# EAGLE design pwm-board (EAGLE 5.03)
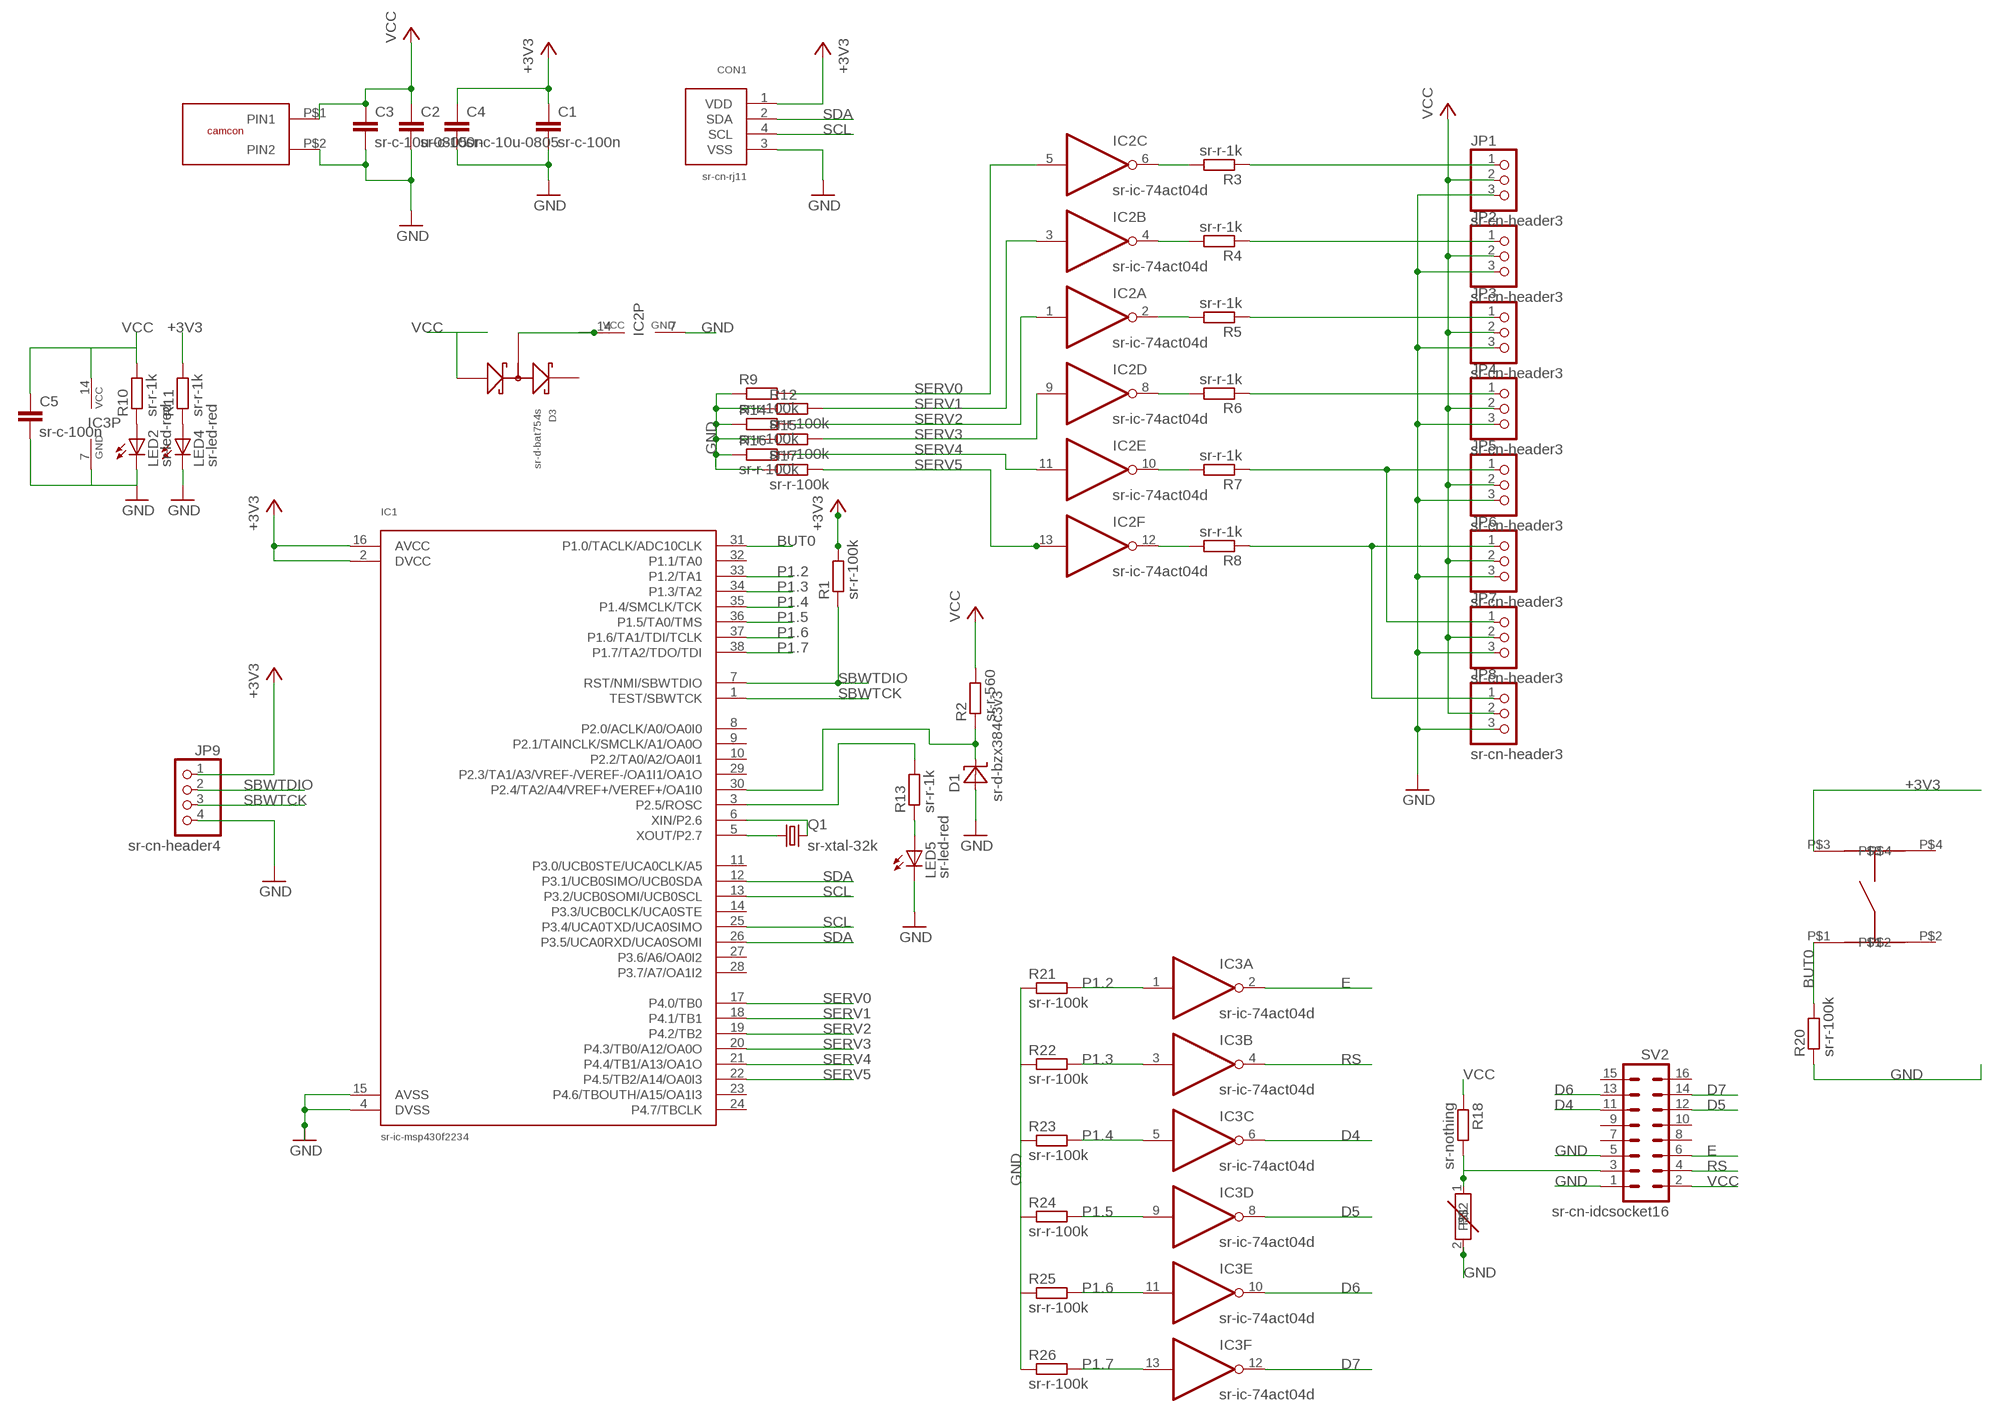
[diagram p0: schematic, sheet 1]

## Parts
C1  sr-c-100n  C-EUC0603K  [C0603K]
C2  sr-c-100n  C-EUC0603K  [C0603K]
C3  sr-c-10u-0805  C-EUC0805  [C0805]
C4  sr-c-10u-0805  C-EUC0805  [C0805]
C5  sr-c-100n  C-EUC0603  [C0603]
CON1  sr-cn-rj11  MODULE_CON  [RJ11-4P4C]
D1  sr-d-bzx384c3v3  ZENERBZX384-C3V3  [SOD323-W]
D3  sr-d-bat754s  BAT754S  [SOT23]
IC1  sr-ic-msp430f2234  MSP430F2234  [TSSOP38]
IC2  sr-ic-74act04d  74ACT04D  [SO14]
IC3  sr-ic-74act04d  74ACT04D  [SO14]
JP1  sr-cn-header3  PINHD-1X3  [1X03]
JP2  sr-cn-header3  PINHD-1X3  [1X03]
JP3  sr-cn-header3  PINHD-1X3  [1X03]
JP4  sr-cn-header3  PINHD-1X3  [1X03]
JP5  sr-cn-header3  PINHD-1X3  [1X03]
JP6  sr-cn-header3  PINHD-1X3  [1X03]
JP7  sr-cn-header3  PINHD-1X3  [1X03]
JP8  sr-cn-header3  PINHD-1X3  [1X03]
JP9  sr-cn-header4  PINHD-1X4  [1X04]
LED2  sr-led-red  LEDCHIP-LED0603  [CHIP-LED0603]
LED4  sr-led-red  LEDCHIP-LED0603  [CHIP-LED0603]
LED5  sr-led-red  LEDCHIP-LED0603  [CHIP-LED0603]
Q1  sr-xtal-32k  CRYSTALTC26V  [TC26V]
R1  sr-r-100k  R-EU_R0603  [R0603]
R2  sr-r-560  R-EU_R0603  [R0603]
R3  sr-r-1k  R-EU_R0603  [R0603]
R4  sr-r-1k  R-EU_R0603  [R0603]
R5  sr-r-1k  R-EU_R0603  [R0603]
R6  sr-r-1k  R-EU_R0603  [R0603]
R7  sr-r-1k  R-EU_R0603  [R0603]
R8  sr-r-1k  R-EU_R0603  [R0603]
R9  sr-r-100k  R-EU_R0603  [R0603]
R10  sr-r-1k  R-EU_R0603  [R0603]
R11  sr-r-1k  R-EU_R0603  [R0603]
R12  sr-r-100k  R-EU_R0603  [R0603]
R13  sr-r-1k  R-EU_R0603  [R0603]
R14  sr-r-100k  R-EU_R0603  [R0603]
R15  sr-r-100k  R-EU_R0603  [R0603]
R16  sr-r-100k  R-EU_R0603  [R0603]
R17  sr-r-100k  R-EU_R0603  [R0603]
R18  sr-nothing  R-EU_R0603  [R0603]
R20  sr-r-100k  R-EU_R0603  [R0603]
R21  sr-r-100k  R-EU_R0603  [R0603]
R22  sr-r-100k  R-EU_R0603  [R0603]
R23  sr-r-100k  R-EU_R0603  [R0603]
R24  sr-r-100k  R-EU_R0603  [R0603]
R25  sr-r-100k  R-EU_R0603  [R0603]
R26  sr-r-100k  R-EU_R0603  [R0603]
SV2  sr-cn-idcsocket16  ML163M  [3M_16]
U$1  sr-cn-camcon2w  CAMCON2W  [09CON2W]
U$2  sr-nothing  R-CUT  [R0603]
U$3  sr-sw-button  09SWITCH  [09SW]

## Nets
+3V3: C1.1 C4.1 CON1.1(VDD) IC1.2(DVCC) IC1.16(AVCC) JP9.1 R1.2 R11.2 U$3.P$3
BUT0: IC1.31(P1.0/TACLK/ADC10CLK) R20.2 U$3.P$1
D4: IC3.6(C:O) SV2.11
D5: IC3.8(D:O) SV2.12
D6: IC3.10(E:O) SV2.13
D7: IC3.12(F:O) SV2.14
E: IC3.2(A:O) SV2.6
GND: C1.2 C2.2 C3.2 C4.2 C5.2 CON1.3(VSS) D1.A IC1.4(DVSS) IC1.15(AVSS) IC2.7(P:GND) IC3.7(P:GND) JP1.3 JP2.3 JP3.3 JP4.3 JP5.3 JP6.3 JP7.3 JP8.3 JP9.4 LED2.C LED4.C LED5.C R9.1 R12.1 R14.1 R15.1 R16.1 R17.1 R20.1 R21.1 R22.1 R23.1 R24.1 R25.1 R26.1 SV2.1 SV2.5 U$1.P$2(PIN2) U$2.2
N$1: JP5.1 JP7.1 R7.1
N$2: JP6.1 JP8.1 R8.1
N$3: D1.C IC1.30(P2.4/TA2/A4/VREF+/VEREF+/OA1I0) R2.1
N$4: IC2.6(C:O) R3.2
N$5: IC2.4(B:O) R4.2
N$7: IC2.2(A:O) R5.2
N$8: IC2.8(D:O) R6.2
N$9: IC2.10(E:O) R7.2
N$10: LED2.A R10.1
N$11: D3.3(MID) IC2.14(P:VCC)
N$12: LED4.A R11.1
N$13: IC2.12(F:O) R8.2
N$14: JP1.1 R3.1
N$15: JP2.1 R4.1
N$16: JP3.1 R5.1
N$17: JP4.1 R6.1
N$22: IC1.5(XOUT/P2.7) Q1.1
N$23: IC1.3(P2.5/ROSC) R13.2
N$24: IC1.6(XIN/P2.6) Q1.2
N$26: LED5.A R13.1
N$28: R18.2 SV2.3 U$2.1
P1.2: IC1.33(P1.2/TA1) IC3.1(A:I) R21.2
P1.3: IC1.34(P1.3/TA2) IC3.3(B:I) R22.2
P1.4: IC1.35(P1.4/SMCLK/TCK) IC3.5(C:I) R23.2
P1.5: IC1.36(P1.5/TA0/TMS) IC3.9(D:I) R24.2
P1.6: IC1.37(P1.6/TA1/TDI/TCLK) IC3.11(E:I) R25.2
P1.7: IC1.38(P1.7/TA2/TDO/TDI) IC3.13(F:I) R26.2
RS: IC3.4(B:O) SV2.4
SBWTCK: IC1.1(TEST/SBWTCK) JP9.3
SBWTDIO: IC1.7(RST/NMI/SBWTDIO) JP9.2 R1.1
SCL: CON1.4(SCL) IC1.13(P3.2/UCB0SOMI/UCB0SCL) IC1.25(P3.4/UCA0TXD/UCA0SIMO)
SDA: CON1.2(SDA) IC1.12(P3.1/UCB0SIMO/UCB0SDA) IC1.26(P3.5/UCA0RXD/UCA0SOMI)
SERV0: IC1.17(P4.0/TB0) IC2.5(C:I) R9.2
SERV1: IC1.18(P4.1/TB1) IC2.3(B:I) R12.2
SERV2: IC1.19(P4.2/TB2) IC2.1(A:I) R14.2
SERV3: IC1.20(P4.3/TB0/A12/OA0O) IC2.9(D:I) R15.2
SERV4: IC1.21(P4.4/TB1/A13/OA1O) IC2.11(E:I) R16.2
SERV5: IC1.22(P4.5/TB2/A14/OA0I3) IC2.13(F:I) R17.2
VCC: C2.1 C3.1 C5.1 D3.1(ANODE) IC3.14(P:VCC) JP1.2 JP2.2 JP3.2 JP4.2 JP5.2 JP6.2 JP7.2 JP8.2 R2.2 R10.2 R18.1 SV2.2 U$1.P$1(PIN1)
Unconnected: D3.2(CATHODE) IC1.8(P2.0/ACLK/A0/OA0I0) IC1.9(P2.1/TAINCLK/SMCLK/A1/OA0O) IC1.10(P2.2/TA0/A2/OA0I1) IC1.11(P3.0/UCB0STE/UCA0CLK/A5) IC1.14(P3.3/UCB0CLK/UCA0STE) IC1.23(P4.6/TBOUTH/A15/OA1I3) IC1.24(P4.7/TBCLK) IC1.27(P3.6/A6/OA0I2) IC1.28(P3.7/A7/OA1I2) IC1.29(P2.3/TA1/A3/VREF-/VEREF-/OA1I1/OA1O) IC1.32(P1.1/TA0) SV2.7 SV2.8 SV2.9 SV2.10 SV2.15 SV2.16 U$3.P$2 U$3.P$4

## Library data of the parts
C1-C5 = rcl:C-EU: CAPACITOR, European symbol
CON1 = ecssr:MODULE_CON
D1 = ecssr:ZENER
D3 = ecssr:BAT754S
IC1 = ecssr:MSP430F2234
IC2 IC3 = 74xx-eu:74*04: Hex INVERTER
JP1-JP8 = pinhead:PINHD-1X3: PIN HEADER
JP9 = pinhead:PINHD-1X4: PIN HEADER
LED2 LED4 LED5 = led:LED: LED OSRAM: - CHIPLED LG R971, LG N971, LY N971, LG Q971, LY Q971, LO R971, LY R971 LH N974, LH R974 LS Q976, LO Q976, LY Q976 LO Q996 - Hyper CHIPLED LW Q18S LB Q993, LB Q99A, LB R99A - SideLED LS A670, LO A670, LY A670, LG A670, LP A670 LB A673, LV A673, LT A673, LW A673 LH A674 LY A675 LS A676, LA A676, LO A676, LY A676, LW A676 LS A679, LY A679, LG A679 - Hyper Micro SIDELED® LS Y876, LA Y876, LO Y876, LY Y876 LT Y87S - SmartLED LW L88C, LW L88S LB L89C, LB L89S, LG L890 LS L89K, LO L89K, LY L89K LS L896, LA L896, LO L896, LY L896 - TOPLED LS T670, LO T670, LY T670, LG T670, LP T670 LSG T670, LSP T670, LSY T670, LOP T670, LYG T670 LG T671, LOG T671, LSG T671 LB T673, LV T673, LT T673, LW T673 LH T674 LS T676, LA T676, LO T676, LY T676, LB T676, LH T676, LSB T676, LW T676 LB T67C, LV T67C, LT T67C, LS T67K, LO T67K, LY T67K, LW E67C LS E67B, LA E67B, LO E67B, LY E67B, LB E67C, LV E67C, LT E67C LW T67C LS T679, LY T679, LG T679 LS T770, LO T770, LY T770, LG T770, LP T770 LB T773, LV T773, LT T773, LW T773 LH T774 LS E675, LA E675, LY E675, LS T675 LS T776, LA T776, LO T776, LY T776, LB T776 LHGB T686 LT T68C, LB T68C - Hyper Mini TOPLED® LB M676 - Mini TOPLED Santana® LG M470 LS M47K, LO M47K, LY M47K Source: http://www.osram.convergy.de - LUMILED® LXK2-PW12-R00, LXK2-PW12-S00, LXK2-PW14-U00, LXK2-PW14-V00 LXK2-PM12-R00, LXK2-PM12-S00, LXK2-PM14-U00 LXK2-PE12-Q00, LXK2-PE12-R00, LXK2-PE12-S00, LXK2-PE14-T00, LXK2-PE14-U00 LXK2-PB12-K00, LXK2-PB12-L00, LXK2-PB12-M00, LXK2-PB14-N00, LXK2-PB14-P00, LXK2-PB14-Q00 LXK2-PR12-L00, LXK2-PR12-M00, LXK2-PR14-Q00, LXK2-PR14-R00 LXK2-PD12-Q00, LXK2-PD12-R00, LXK2-PD12-S00 LXK2-PH12-R00, LXK2-PH12-S00 LXK2-PL12-P00, LXK2-PL12-Q00, LXK2-PL12-R00 Source: www.luxeon.com
Q1 = crystal:CRYSTAL: CRYSTAL
R1-R18 R20-R26 = rcl:R-EU_: RESISTOR, European symbol
SV2 = con-harting-ml:ML16: HARTING
U$1 = ecssr-Pwr:CAMCON2W
U$2 = ecssr:R-CUT
U$3 = ecssr-Pwr:09SWITCH

## Board
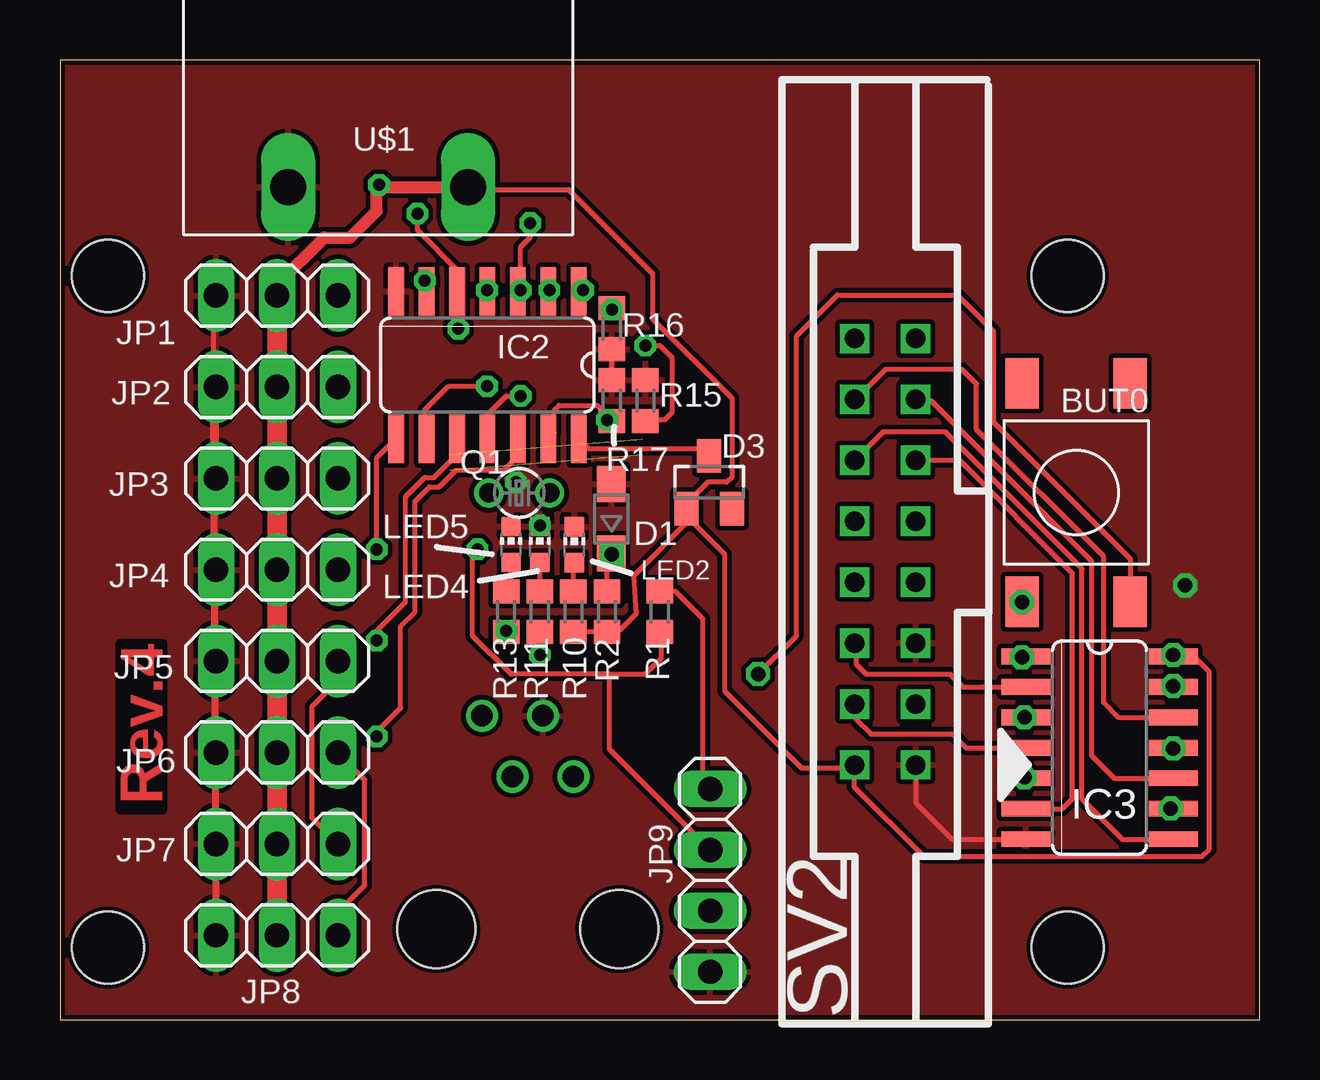
[diagram p1: board, top side]
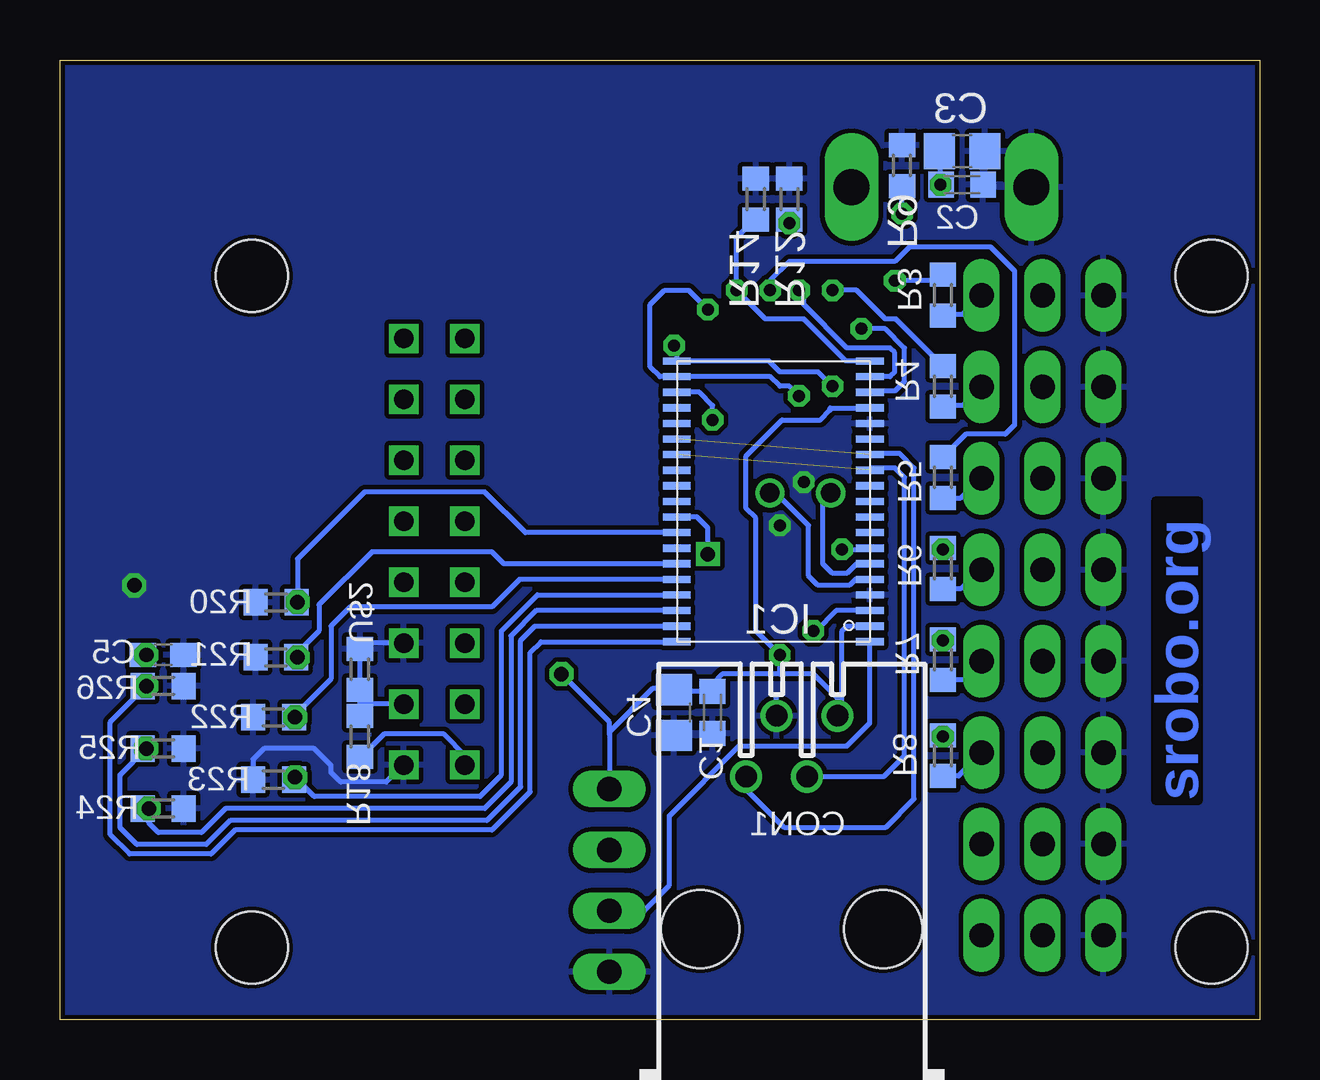
[diagram p2: board, bottom side, seen from below]

Size 50 x 40 mm. Coordinates in mm from the lower left corner, seen from the top.
Outline: 0,40 0,0 50,0 50,40 0,40
Copper layers (1*16): Top 0.035mm / dielectric 1.5mm / Bottom 0.035mm
Design rules "default": minimum track width 0.2mm, minimum drill 0.5mm, track to track 0.2mm, track to pad 0.2mm, pad to pad 0.2mm, via to via 0.2mm, smd to smd 0mil, copper to edge 0.2mm, drill to drill 0.2mm, minimum pad ring 0.2mm, minimum via ring 0.2mm, stop-mask expansion 0mil, vias tented up to drill 0mil, thermal gap 0.2mm
Holes 3 mm at 2,31 42,31 2,3 42,3

### Footprints (pad centres in the part's own frame; a part is rotated, then mirrored left to right if it is on the bottom)
C0603K = smd 1.05 x 1.08: 1 -0.875,0; 2 0.875,0
C0805 = smd 1.3 x 1.5: 1 -0.95,0; 2 0.95,0
C0603 = smd 1.1 x 1: 1 -0.85,0; 2 0.85,0
RJ11-4P4C = drill 0.889 round: 1 1.905,8.89; 2 0.635,6.35; 3 -0.635,8.89; 4 -1.905,6.35 | hole 3.251: -3.81,0; 3.81,0
SOD323-W = smd 1.5 x 1.2: A 1.45,0; C -1.45,0
SOT23 = smd 1 x 1.4: 1 -0.95,-1.1; 2 0.95,-1.1; 3 0,1.1
TSSOP38 = smd 1.15 x 0.3: 1 0,0; 2 0,-0.65; 3 0,-1.3; 4 0,-1.95; 5 0,-2.6; 6 0,-3.25; 7 0,-3.9; 8 0,-4.55; 9 0,-5.2; 10 0,-5.85; 11 0,-6.5; 12 0,-7.15; 13 0,-7.8; 14 0,-8.45; 15 0,-9.1; 16 0,-9.75; 17 0,-10.4; 18 0,-11.05; 19 0,-11.7; 20 8.05,-11.7; 21 8.05,-11.05; 22 8.05,-10.4; 23 8.05,-9.75; 24 8.05,-9.1; 25 8.05,-8.45; 26 8.05,-7.8; 27 8.05,-7.15; 28 8.05,-6.5; 29 8.05,-5.85; 30 8.05,-5.2; 31 8.05,-4.55; 32 8.05,-3.9; 33 8.05,-3.25; 34 8.05,-2.6; 35 8.05,-1.95; 36 8.05,-1.3; 37 8.05,-0.65; 38 8.05,0
SO14 = smd 0.66 x 2.032: 1 -3.81,-3.073; 2 -2.54,-3.073; 3 -1.27,-3.073; 4 0,-3.073; 5 1.27,-3.073; 6 2.54,-3.073; 7 3.81,-3.073; 8 3.81,3.073; 9 2.54,3.073; 10 1.27,3.073; 11 0,3.073; 12 -1.27,3.073; 13 -2.54,3.073; 14 -3.81,3.073
1X03 = drill 1.016 long: 1 -2.54,0; 2 0,0; 3 2.54,0
1X04 = drill 1.016 long: 1 -3.81,0; 2 -1.27,0; 3 1.27,0; 4 3.81,0
CHIP-LED0603 = smd 0.8 x 0.8: A 0,-0.75; C 0,0.75
TC26V = drill 0.813 round: 1 -1.27,0; 2 1.27,0
R0603 = smd 1 x 1.1: 1 -0.85,0; 2 0.85,0
3M_16 = drill 0.813 square: 1 -8.89,-1.27; 2 -8.89,1.27; 3 -6.35,-1.27; 4 -6.35,1.27; 5 -3.81,-1.27; 6 -3.81,1.27; 7 -1.27,-1.27; 8 -1.27,1.27; 9 1.27,-1.27; 10 1.27,1.27; 11 3.81,-1.27; 12 3.81,1.27; 13 6.35,-1.27; 14 6.35,1.27; 15 8.89,-1.27; 16 8.89,1.27
09CON2W = drill 1.5 long: P$1 -3.75,0; P$2 3.75,0
09SW = smd 1.4 x 2.1: P$1 2.25,4.55; P$2 2.25,-4.55; P$3 -2.25,4.55; P$4 -2.25,-4.55

### Placement (x,y rotation side)
C1  22.8,12.8 270 bottom
C2  12.4,34.8 0 bottom
C3  12.4,36.2 0 bottom
C4  24.4,12.8 270 bottom
C5  45.7,15.2 0 bottom
CON1  19.5,3.77 0 bottom
D1  22.98,20.87 90 top
D3  27.06,22.4 0 top
IC1  sr-ic-msp430f2254  [TSSOP38]  16.24,15.75 180 bottom
IC2  17.82,27.29 180 top
IC3  43.33,11.33 270 top
JP1  9.05,30.18 180 top
JP2  9.04,26.37 180 top
JP3  9.04,22.56 180 top
JP4  9.04,18.75 180 top
JP5  9.04,14.94 180 top
JP6  9.04,11.13 180 top
JP7  9.04,7.32 180 top
JP8  9.04,3.51 180 top
JP9  27.1,5.8 270 top
LED2  21.44,19.79 0 top
LED4  20,19.8 0 top
LED5  18.8,19.8 0 top
Q1  19.14,21.95 180 top
R1  25,17 90 top
R2  22.8,17 270 top
R3  13.2,30.2 90 bottom
R4  13.2,26.4 90 bottom
R5  13.2,22.6 90 bottom
R6  13.2,18.8 90 bottom
R7  13.2,15 90 bottom
R8  13.2,11 90 bottom
R9  14.9,35.6 270 bottom
R10  21.4,17 270 top
R11  20,17 270 top
R12  19.6,34.2 270 bottom
R13  18.6,17 270 top
R14  21,34.2 270 bottom
R15  24.4,25.8 270 top
R16  23,28.8 90 top
R17  23,25.8 270 top
R18  37.5,11.8 90 bottom
R20  40.99,17.39 0 bottom
R21  41,15.1 0 bottom
R22  41.1,12.6 0 bottom
R23  41.1,10 0 bottom
R24  45.7,8.8 180 bottom
R25  45.7,11.3 180 bottom
R26  45.7,13.9 180 bottom
SV2  34.4,19.5 90 top
U$1  13.26,34.7 180 top
U$2  37.5,14.6 90 bottom
U$3  42.36,21.97 180 top

### Tracks (layer width: path | path; a pad name or v marks a point on that pad's centre or on a via)
+3V3  (via drill 0.5, 0.6)
  Top 0.2: U$3.P$3 44.61,19.19 38.9,24.9 38.9,28.7 37.4,30.2 32.4,30.2 30.7,28.5 30.7,16 v29.1,14.4 | R1.2 25.65,17.85 26.8,16.7 26.8,9.9 JP9.1 | v20,15.2 R11.2 v20,15.2
  Bottom 0.2: IC1.2 17.2,16.4 17.4,16.2 17.4,12.8 | 20,14.4 18.6,14.4 17.6,13.4 17.6,12.7 17.59,12.69 CON1.1 | 20,14.4 22.4,14.4 22.8,14 C1.1 24.27,13.68 24.3,13.7 | 20,14.4 v20,15.2 21,16.2 21,20.9 21.4,21.3 21.4,23.5 19.9,25 18.3,25 17.9,25.4 17.9,25.5 IC1.16 | 24.4,13.8 C4.1 24.35,13.75 24.3,13.7 | 27.1,11.9 27.1,12 25.3,13.8 24.4,13.8 | 27.1,11.9 JP9.1 | 24.3,13.7 24.4,13.8 | v29.1,14.4 27.1,12.4 27.1,11.9
  Bottom 0.406: 17.4,12.8 17.59,12.8 CON1.1
BUT0  (via drill 0.6)
  Top 0.2: v40.1,17.4 U$3.P$1
  Bottom 0.2: R20.2 40.14,17.56 v40.1,17.4 40.1,19.2 37.3,22 32.3,22 30.6,20.3 IC1.31
D4
  Top 0.2: IC3.6 41.79,8.79 42.2,9.2 42.2,18.6 37.5,23.3 SV2.11
D5
  Top 0.2: IC3.8 44.28,7.52 42.6,9.2 42.6,18.8 36.9,24.5 34.3,24.5 33.11,23.31 | 33.11,23.31 33.1,23.3 | 33.11,23.31 SV2.12
D6
  Top 0.2: IC3.10 43.94,10.06 43,11 43,19.1 36.3,25.8 35.62,25.8 | 35.62,25.8 35.6,25.8 | 35.62,25.8 SV2.13
D7
  Top 0.2: IC3.12 44.1,12.6 43.5,13.2 43.5,19.3 38.2,24.6 38.2,26.5 37.6,27.1 34.4,27.1 33.13,25.83 | 33.13,25.83 33.1,25.8 | 33.13,25.83 SV2.14
E
  Top 0.2: IC3.2 37.63,13.87 37.1,14.4 33.6,14.4 33.2,14.8 33.2,15.6 33.11,15.69 | 33.11,15.69 33.1,15.7 | 33.11,15.69 SV2.6
GND  (via drill 0.5, 0.6)
  Top 0.2: 6.4,26.4 | 6.4,26.4 6.42,26.4 6.42,30.02 6.58,30.18 | 6.4,26.4 6.43,26.37 JP2.3 JP3.3 | JP3.3 | JP3.3 | 6.58,30.18 6.6,30.2 | 6.58,30.18 JP1.3 | 23.05,28 R16.1 R17.1 23,26.6 | IC3.7 37.18,7.52 35.7,9 35.7,10.6 35.69,10.61 SV2.1
  Top 0.3: 6.45,3.5 JP8.3 6.42,26.4
  Bottom 0.2: CON1.3 20.13,13.47 | SV2.5 37.35,15.7 U$2.2 | R23.1 41.95,10.85 41.5,11.3 39.4,11.3 38.7,10.6 38.7,10.3 38.3,9.9 36.4,9.9 35.69,10.61 SV2.1
  other vias: 20,20.6 46.9,18.1 19,22.4
  pour Top (isolate 0.2): -0.3,-0.4 -0.3,40.7 50.6,40.7 50.6,-0.4
  pour Bottom (isolate 0.2): -0.1,-0.6 -0.1,40.9 50.9,40.9 50.9,-0.6
N$1
  Top 0.2: JP5.1 11.53,15 11.5,15 11.5,14.05 10.5,13.05 10.5,8.4 JP7.1
  Bottom 0.2: JP5.1 11.6,15 | JP5.1 | R7.1 11.6,14.15 JP5.1
N$2
  Top 0.2: JP8.1 11.6,3.52 11.6,4.5 12.7,5.6 12.7,10 11.59,11.12 JP6.1
  Bottom 0.2: JP6.1 11.59,11.12 12.55,10.15 R8.1
N$3  (via drill 0.6)
  Top 0.2: v23,19.4 22.86,19.26 | R2.1 22.8,19.2 v23,19.4 | v23,19.4 D1.C
  Bottom 0.2: IC1.30 23.45,20.95 23,20.5 v23,19.4
N$4  (via drill 0.5)
  Top 0.2: IC2.6 15.4,30.36 15.4,30.4 v15.2,30.8
  Bottom 0.2: R3.2 13.6,30.8 v15.2,30.8
N$5  (via drill 0.5)
  Top 0.2: 17.8,30 17.8,30.34 IC2.4 17.8,30.37 v17.8,30.4
  Bottom 0.2: R4.2 15.15,29.2 15.6,29.2 16.8,30.4 v17.8,30.4
N$7  (via drill 0.5)
  Top 0.2: IC2.2 20.36,30.25 20.4,30.2 v20.4,30.4
  Bottom 0.2: R5.2 12.25,24.4 10.6,24.4 10.2,24.8 10.2,31.2 11.2,32.2 14.6,32.2 15.2,31.6 19.6,31.6 20.4,30.8 v20.4,30.4
N$8  (via drill 0.5)
  Top 0.2: IC2.8 13.2,23.41 v13.2,19.6
  Bottom 0.2: R6.2 v13.2,19.6 R6.2
N$9  (via drill 0.5)
  Top 0.2: IC2.10 16.55,23.55 15.6,22.6 15.2,22.6 14.4,21.8 14.4,17.4 13.2,16.2 v13.2,15.8
  Bottom 0.2: R7.2 v13.2,15.8 R7.2
N$10
  Top 0.2: LED2.A 21.4,19 R10.1
N$11
  Top 0.2: D3.3 27,23.56 27,23.8 22.04,23.8 IC2.14
N$12
  Top 0.2: R11.1 LED4.A
N$13  (via drill 0.5)
  Top 0.2: IC2.12 19.09,23.48 18.5,22.9 16.5,22.9 15.8,22.2 15.4,22.2 14.8,21.6 14.8,17 14.2,16.4 14.2,13 13.2,12 v13.2,11.8
  Bottom 0.2: R8.2 v13.2,11.8
N$14
  Bottom 0.2: R3.1 13.2,29.4 12.37,29.4 JP1.1
N$15
  Bottom 0.2: R4.1 13.2,25.6 12.36,25.6 JP2.1
N$16
  Bottom 0.2: JP3.1 11.59,22.59 11.6,22.6 12.45,21.75 R5.1
N$17
  Bottom 0.2: JP4.1 11.59,18.79 11.6,18.8 12.45,17.95 R6.1
N$22
  Bottom 0.2: IC1.5 16.85,18.35 17.1,18.1 18.4,18.1 18.8,18.5 18.8,20.6 20.2,22 20.25,21.95 Q1.1
N$23  (via drill 0.5)
  Top 0.2: 18.6,16 R13.2 v18.6,16.2
  Bottom 0.2: v18.6,16.2 18.5,16.2 17.65,17.05 IC1.3
N$24
  Bottom 0.2: IC1.6 16.8,19 17.2,18.6 17.8,18.6 18.2,19 18.2,21.5 17.77,21.93 Q1.2
N$26
  Top 0.2: R13.1 18.75,18 18.8,18 LED5.A
N$28
  Bottom 0.2: 37.5,12.6 R18.2 37.5,13.2 | 37.5,13.2 U$2.1 | SV2.3 37.45,13.15 37.5,13.2
P1.2  (via drill 0.6)
  Top 0.2: IC3.1 40.26,15.16 v40.1,15.1
  Bottom 0.2: v40.1,15.1 R21.2 | v40.1,15.1 40.2,15.2 | IC1.33 31.5,19 32,19.5 37,19.5 39.2,17.3 39.2,16.2 40.1,15.3 v40.1,15.1
P1.3  (via drill 0.6)
  Top 0.2: 40.3,12.6 IC3.3 v40.2,12.6
  Bottom 0.2: 40.3,12.7 v40.2,12.6 R22.2 40.3,12.6 38.7,14.2 38.7,16.4 37.9,17.2 32,17.2 30.85,18.35 IC1.34
P1.4  (via drill 0.6)
  Top 0.2: IC3.5 40.2,10 v40.2,10.1
  Bottom 0.2: R23.2 v40.2,10.1 39.4,9.3 32.5,9.3 31.6,10.2 31.6,16.2 30.1,17.7 IC1.35
P1.5  (via drill 0.6)
  Top 0.2: IC3.9 v46.3,8.8
  Bottom 0.2: R24.2 46.55,8.85 v46.3,8.8 46.2,8.8 46.3,8.7 46.3,8.2 45.9,7.8 44.1,7.8 43.1,8.8 32.3,8.8 31.2,9.9 31.2,16 30.15,17.05 IC1.36
P1.6  (via drill 0.6)
  Top 0.2: v46.4,11.3 IC3.11
  Bottom 0.2: R25.2 v46.4,11.3 47.5,10.2 47.5,8 46.8,7.3 43.9,7.3 42.9,8.3 32.2,8.3 30.8,9.7 30.8,15.8 30.2,16.4 IC1.37
P1.7  (via drill 0.6)
  Top 0.2: v46.4,13.9 IC3.13
  Bottom 0.2: R26.2 v46.4,13.9 47.9,12.4 47.9,7.7 47.1,6.9 43.7,6.9 42.7,7.9 32,7.9 30.4,9.5 30.4,15.3 29.95,15.75 IC1.38
RS
  Top 0.2: IC3.4 37.77,11.33 37.2,11.9 33.8,11.9 33.2,12.5 33.2,13.1 33.13,13.17 | 33.13,13.17 33.1,13.2 | 33.13,13.17 SV2.4
SBWTCK
  Bottom 0.2: IC1.1 16.24,12.36 17.2,11.4 21.7,11.4 24.6,8.5 24.6,5.6 25.7,4.5 27.1,4.5 JP9.3
SBWTDIO  (via drill 0.5)
  Top 0.2: v17.4,19.6 17.2,19.4 17.2,16 18.8,14.4 22.9,14.4 | 22.9,14.4 24.4,14.4 25.07,15.07 25.07,15.93 25,16 R1.1 | JP9.2 22.9,11.27 22.9,14.4
  Bottom 0.2: IC1.7 16.29,19.6 v17.4,19.6
SCL  (1 unrouted)
  Bottom 0.2: CON1.4 21.4,9.6 19.8,8 15.6,8 14.4,9.2 14.4,23 15,23.6 16.2,23.6 IC1.13
SDA  (1 unrouted)
  Bottom 0.2: CON1.2 15.68,10.12 14.8,11 14.8,22.6 15.2,23 16.2,23 16.24,22.96 IC1.12
SERV0  (via drill 0.5)
  Top 0.2: v16.6,28.8 16.55,28.86 IC2.5 16.55,30.55 16.6,30.6 16.6,31.2 14.9,32.9 v14.9,33.6
  Bottom 0.2: v16.6,28.8 15.6,28.8 14.8,28 14.8,26.6 15.2,26.2 16.2,26.2 IC1.17 | 14.9,34.8 R9.2 v14.9,33.6
SERV1  (via drill 0.5)
  Top 0.2: IC2.3 19.2,30.24 v19.2,30.4 19.2,32.2 19.6,32.6 v19.6,33.2
  Bottom 0.2: IC1.18 15.4,26.8 15.2,27 15.2,27.8 15.4,28 17.2,28 19,29.8 19,30.2 v19.2,30.4 | 19.2,32.95 R12.2 v19.6,33.2
SERV2  (via drill 0.5)
  Top 0.2: 21.62,30.38 21.6,30.4 | 21.62,30.38 IC2.1 | v21.8,30.4 21.8,30.2 21.62,30.38
  Bottom 0.2: R14.2 21,33.4 21.8,32.6 v21.8,30.4 20.6,29.2 19,29.2 17.25,27.45 IC1.19
SERV3  (via drill 0.5)
  Top 0.2: v17.8,26.4 16.2,26.4 15.2,25.4 15.2,24.2 15.28,24.12 | 15.28,24.12 15.4,24 | IC2.9 15.28,24.12 | v24.4,28.1 25,28.1 25.5,27.6 25.5,25.3 25.2,25 24.4,25 R15.2
  Bottom 0.2: v17.8,26.4 18.4,27 20,27 20.45,27.45 IC1.20 24.29,27.99 v24.4,28.1
SERV4  (via drill 0.5)
  Top 0.2: v19.2,26 18.6,26 17.8,25.2 17.8,24.2 IC2.11 | v23,29.6 R16.2 v23,29.6
  Bottom 0.2: v19.2,26 19.6,26.4 20,26.4 20.4,26.8 IC1.21 25,26.8 25.4,27.2 25.4,29.8 24.8,30.4 23.8,30.4 v23,29.6
SERV5  (via drill 0.5)
  Top 0.2: R17.2 v22.8,25 22.8,25.2 22.4,25.6 20.8,25.6 20.6,25.4 20.6,24.46 IC2.13
  Bottom 0.2: IC1.22 23.35,26.15 22.8,25.6 v22.8,25
VCC  (via drill 0.5, 0.6)
  Top 0.2: 22.8,16.2 22.84,16.06 R2.2 | R10.2 22.75,16.15 22.8,16.2 | 22.8,16.2 23.3,16.2 24,16.9 23.9,18.5 26.3,20.9 26.11,21.09 D3.1 | D3.1 26.2,21.2 26.2,21.6 27,22.4 27.8,22.4 28,22.6 28,25.9 24.7,29.2 24.7,31.1 21.2,34.6 17,34.6 U$1.P$1 | 13.2,34.7 13.2,35 v13.3,34.8 | 46.4,15.1 IC3.14 | 46.4,15.1 v46.4,15.2 | 46.4,15.1 46.5,15.2 | 46.4,15.1 47.3,15.1 47.9,14.5 47.9,7.1 47.6,6.8 36,6.8 33.1,9.7 33.1,10.5 | SV2.2 33.11,10.61 33.1,10.6 33.1,10.5 | D3.1 25.8,21.3 27.7,19.4 27.7,13.7 30.9,10.5 33.1,10.5
  Top 0.3: 9.04,2.88 9.04,2.94 JP8.2
  Top 0.5: JP1.2 9.05,30.65 11,32.6 12.1,32.6 13.2,33.7 13.2,34.7 U$1.P$1
  Top 0.813: JP1.2 JP2.2 JP3.2 JP4.2 JP5.2 JP6.2 JP7.2 JP8.2
  Bottom 0.2: 13.2,34.8 C2.1 v13.3,34.8 13.3,36.15 C3.1 | R18.1 37.45,10.95 36.5,11.9 34,11.9 33.1,11 33.13,10.97 SV2.2 | v46.4,15.2 C5.1

### Text on the board
Top: Rev.4
Bottom: srobo.org
tNames: PWM Board TOP | U$1 | BUT0